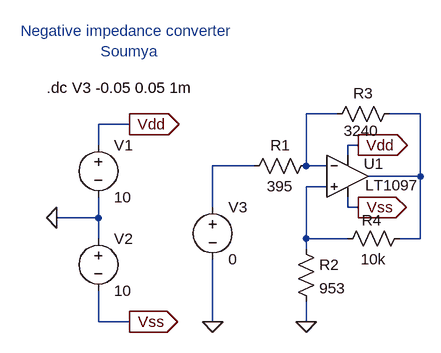
[diagram p0: schematic nic.asc]
nic.asc, the LTspice schematic file:
Version 4
SHEET 1 880 680
WIRE 96 32 48 32
WIRE 224 32 176 32
WIRE -224 48 -272 48
WIRE -272 80 -272 48
WIRE 128 80 112 80
WIRE 112 96 112 80
WIRE -32 112 -96 112
WIRE 48 112 48 32
WIRE 80 112 48 112
WIRE 224 128 224 32
WIRE 224 128 144 128
WIRE 80 144 48 144
WIRE -96 176 -96 112
WIRE 112 176 112 160
WIRE 128 176 112 176
WIRE -272 192 -272 160
WIRE -272 192 -336 192
WIRE -272 224 -272 192
WIRE 48 224 48 144
WIRE 112 224 48 224
WIRE 224 224 224 128
WIRE 224 224 192 224
WIRE 48 240 48 224
WIRE -272 352 -272 304
WIRE -224 352 -272 352
WIRE -96 352 -96 256
WIRE 48 352 48 320
FLAG -336 192 0
FLAG -224 48 Vdd
IOPIN -224 48 Out
FLAG -224 352 Vss
IOPIN -224 352 Out
FLAG 128 80 Vdd
IOPIN 128 80 Out
FLAG 128 176 Vss
IOPIN 128 176 Out
FLAG 48 352 0
FLAG -96 352 0
SYMBOL voltage -272 64 R0
WINDOW 123 0 0 Left 0
WINDOW 39 0 0 Left 0
SYMATTR InstName V1
SYMATTR Value 10
SYMBOL voltage -272 208 R0
WINDOW 123 0 0 Left 0
WINDOW 39 0 0 Left 0
SYMATTR InstName V2
SYMATTR Value 10
SYMBOL OpAmps\\LT1097 112 64 R0
WINDOW 0 25 45 Left 2
WINDOW 3 27 78 Left 2
SYMATTR InstName U1
SYMBOL res 64 96 R90
WINDOW 0 0 56 VBottom 2
WINDOW 3 32 56 VTop 2
SYMATTR InstName R1
SYMATTR Value 395
SYMBOL res 32 224 R0
SYMATTR InstName R2
SYMATTR Value 953
SYMBOL res 192 16 R90
WINDOW 0 0 56 VBottom 2
WINDOW 3 26 59 VTop 2
SYMATTR InstName R3
SYMATTR Value 3240
SYMBOL res 208 208 R90
WINDOW 0 3 59 VBottom 2
WINDOW 3 32 56 VTop 2
SYMATTR InstName R4
SYMATTR Value 10k
SYMBOL voltage -96 160 R0
SYMATTR InstName V3
SYMATTR Value 0
TEXT -352 -8 Left 2 !.dc V3 -0.05 0.05 1m
TEXT -224 -80 Center 2 ;Negative impedance converter \nSoumya

The netlist it stands for:
* nic.asc
V1 Vdd 0 10
V2 0 Vss 10
XU1 N004 N001 Vdd Vss N002 LT1097  ; pins In+ In- V+ V- OUT
R1 N001 N003 395
R2 N004 0 953
R3 N002 N001 3240
R4 N002 N004 10k
V3 N003 0 0
.dc V3 -0.05 0.05 1m
* Negative impedance converter
* Soumya
.backanno
.end